# EAGLE design SchlafKindleinSchlaf (EAGLE 6.5.0)
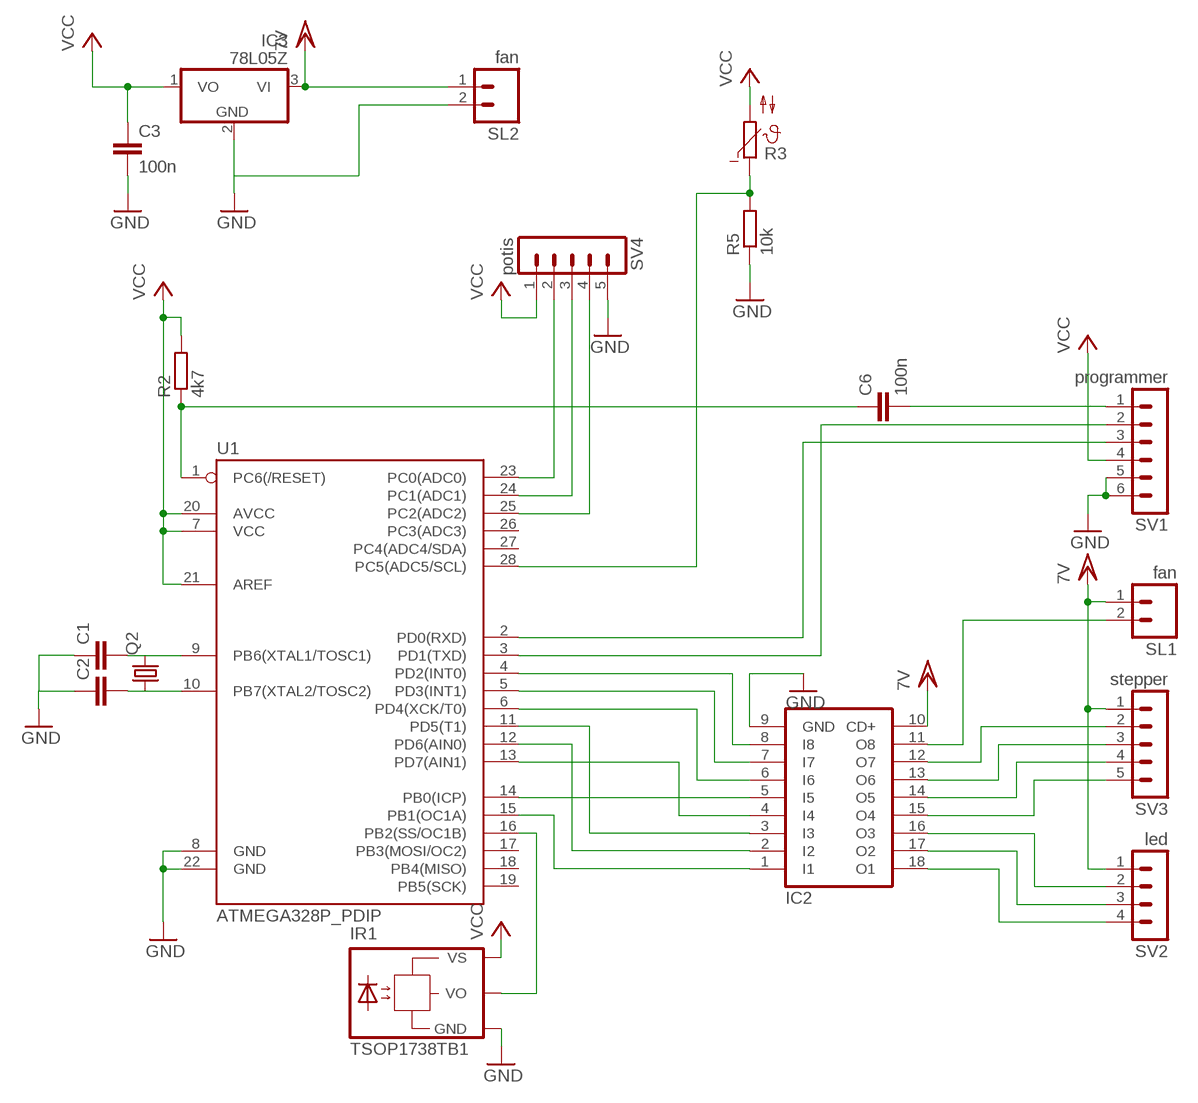
[diagram p0: schematic, sheet 1]

## Parts
C1  C2.5/2  [C2.5-2]
C2  C2.5/2  [C2.5-2]
C3  100n  C2.5/2  [C2.5-2]
C6  100n  C2.5/2  [C2.5-2]
IC2  ULN2803A  [DIL18]
IC3  78L05Z  [TO92]
IR1  TSOP1738TB1  [TSOP17_TB1]
Q2  CRYSTALHC49S  [HC49/S]
R2  4k7  R-EU_0207/7  [0207/7]
R3  NTC640  [P640]
R5  10k  R-EU_0207/7  [0207/7]
SL1  fan  MA02  [02PA]
SL2  fan  MA02  [02PA]
SV1  programmer  MA06-1  [MA06-1]
SV2  led  MA04-1  [MA04-1]
SV3  stepper  MA05-1  [MA05-1]
SV4  potis  MA05-1  [MA05-1]
U1  ATMEGA328P_PDIP  [DIL28-3]

## Nets
GND: C1.1 C2.1 C3.2 IC2.9(GND) IC3.2(GND) IR1.GND R5.1 SL2.2 SV1.5 SV1.6 SV4.5 U1.8(GND) U1.22(GND)
N$1: IC2.1(I1) U1.15(PB1(OC1A))
N$2: IC2.2(I2) U1.12(PD6(AIN0))
N$3: C1.2 Q2.2 U1.9(PB6(XTAL1/TOSC1))
N$4: C2.2 Q2.1 U1.10(PB7(XTAL2/TOSC2))
N$5: IR1.VO U1.16(PB2(SS/OC1B))
N$6: SV1.3 U1.2(PD0(RXD))
N$7: SV1.2 U1.3(PD1(TXD))
N$8: C6.2 SV1.1
N$9: C6.1 R2.1 U1.1(PC6(/RESET))
N$10: IC2.3(I3) U1.11(PD5(T1))
N$11: IC2.8(I8) U1.4(PD2(INT0))
N$12: IC2.7(I7) U1.5(PD3(INT1))
N$13: IC2.6(I6) U1.6(PD4(XCK/T0))
N$14: IC2.5(I5) U1.14(PB0(ICP))
N$15: IC2.4(I4) U1.13(PD7(AIN1))
N$16: IC2.11(O8) SL1.2
N$17: IC2.12(O7) SV3.2
N$18: IC2.13(O6) SV3.3
N$19: IC2.14(O5) SV3.4
N$20: IC2.15(O4) SV3.5
N$21: IC2.16(O3) SV2.2
N$22: IC2.17(O2) SV2.3
N$23: IC2.18(O1) SV2.4
N$24: SV4.2 U1.23(PC0(ADC0))
N$25: SV4.3 U1.24(PC1(ADC1))
N$26: SV4.4 U1.25(PC2(ADC2))
N$27: R3.1 R5.2 U1.28(PC5(ADC5/SCL))
VCC: C3.1 IC3.1(VO) IR1.VS R2.2 R3.2 SV1.4 SV4.1 U1.7(VCC) U1.20(AVCC) U1.21(AREF)
VCC/2: IC2.10(CD+) IC3.3(VI) SL1.1 SL2.1 SV2.1 SV3.1 ; supply symbol labelled 7V
Unconnected: U1.17(PB3(MOSI/OC2)) U1.18(PB4(MISO)) U1.19(PB5(SCK)) U1.26(PC3(ADC3)) U1.27(PC4(ADC4/SDA))

## Library data of the parts
C1-C3 C6 = capacitor-wima:C: CAPACITOR naming: grid - package width
IC2 = uln-udn:ULN2803A: DRIVER ARRAY
IC3 = linear:78*: Positive VOLTAGE REGULATOR Source: http://cache.national.com/ds/LM/LM78L05.pdf http://www.fairchildsemi.com/ds/LM/LM7805.pdf
IR1 = telefunken:TSOP17*TB1: TSOP17..TB1 IR Receiver Modules for Remote Control Systems Source: http://www.vishay.com/docs/82042/82042.pdf; OC_FARNELL: unknown; OC_NEWARK: unknown
Q2 = crystal:CRYSTAL: CRYSTAL; OC_FARNELL: 1667008; OC_NEWARK: unknown
R2 R5 = resistor:R-EU_: RESISTOR, European symbol
R3 = ptc-ntc:NTC640: PHILIPS NTC; OC_FARNELL: unknown; OC_NEWARK: unknown
SL1 SL2 = con-amp-quick:MA02: AMP QUICK CONNECTOR; OC_FARNELL: unknown; OC_NEWARK: unknown
SV1 = con-lstb:MA06-1: PIN HEADER; OC_FARNELL: unknown; OC_NEWARK: unknown
SV2 = con-lstb:MA04-1: PIN HEADER; OC_FARNELL: unknown; OC_NEWARK: unknown
SV3 SV4 = con-lstb:MA05-1: PIN HEADER; OC_FARNELL: unknown; OC_NEWARK: unknown
U1 = SparkFun-DigitalIC:ATMEGA328P_PDIP: uC used in the Arduino 32kb flash, 1k EEPROM, 2k SRAM This is the through-hole version of this chip.

## Board
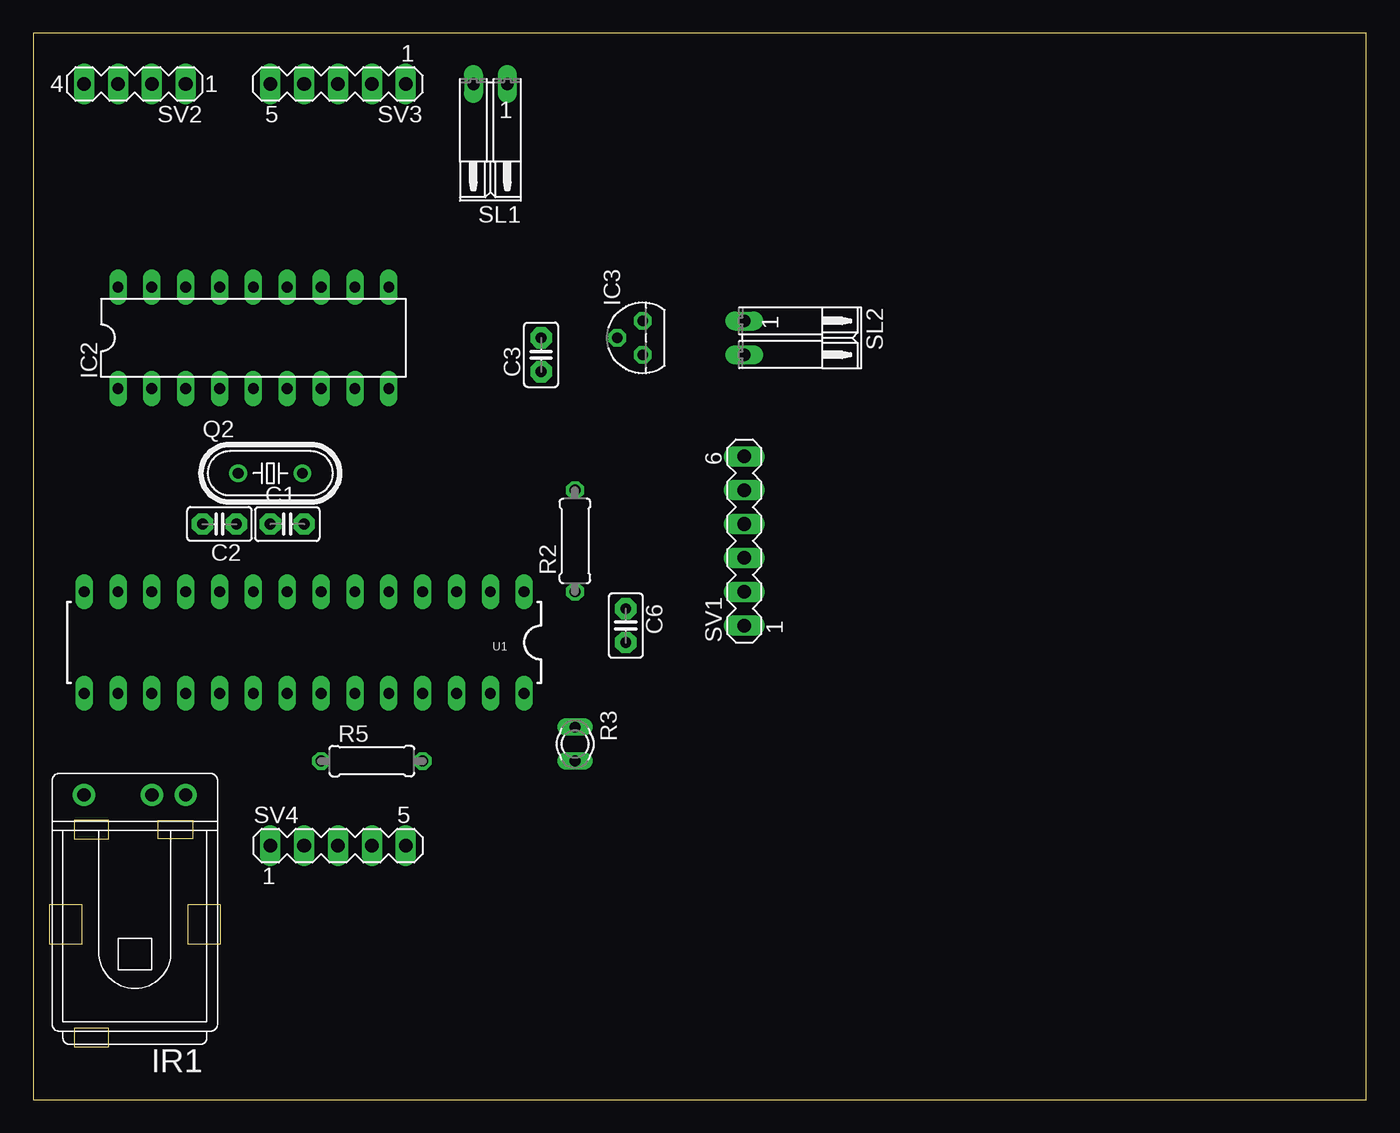
[diagram p1: board, top side]
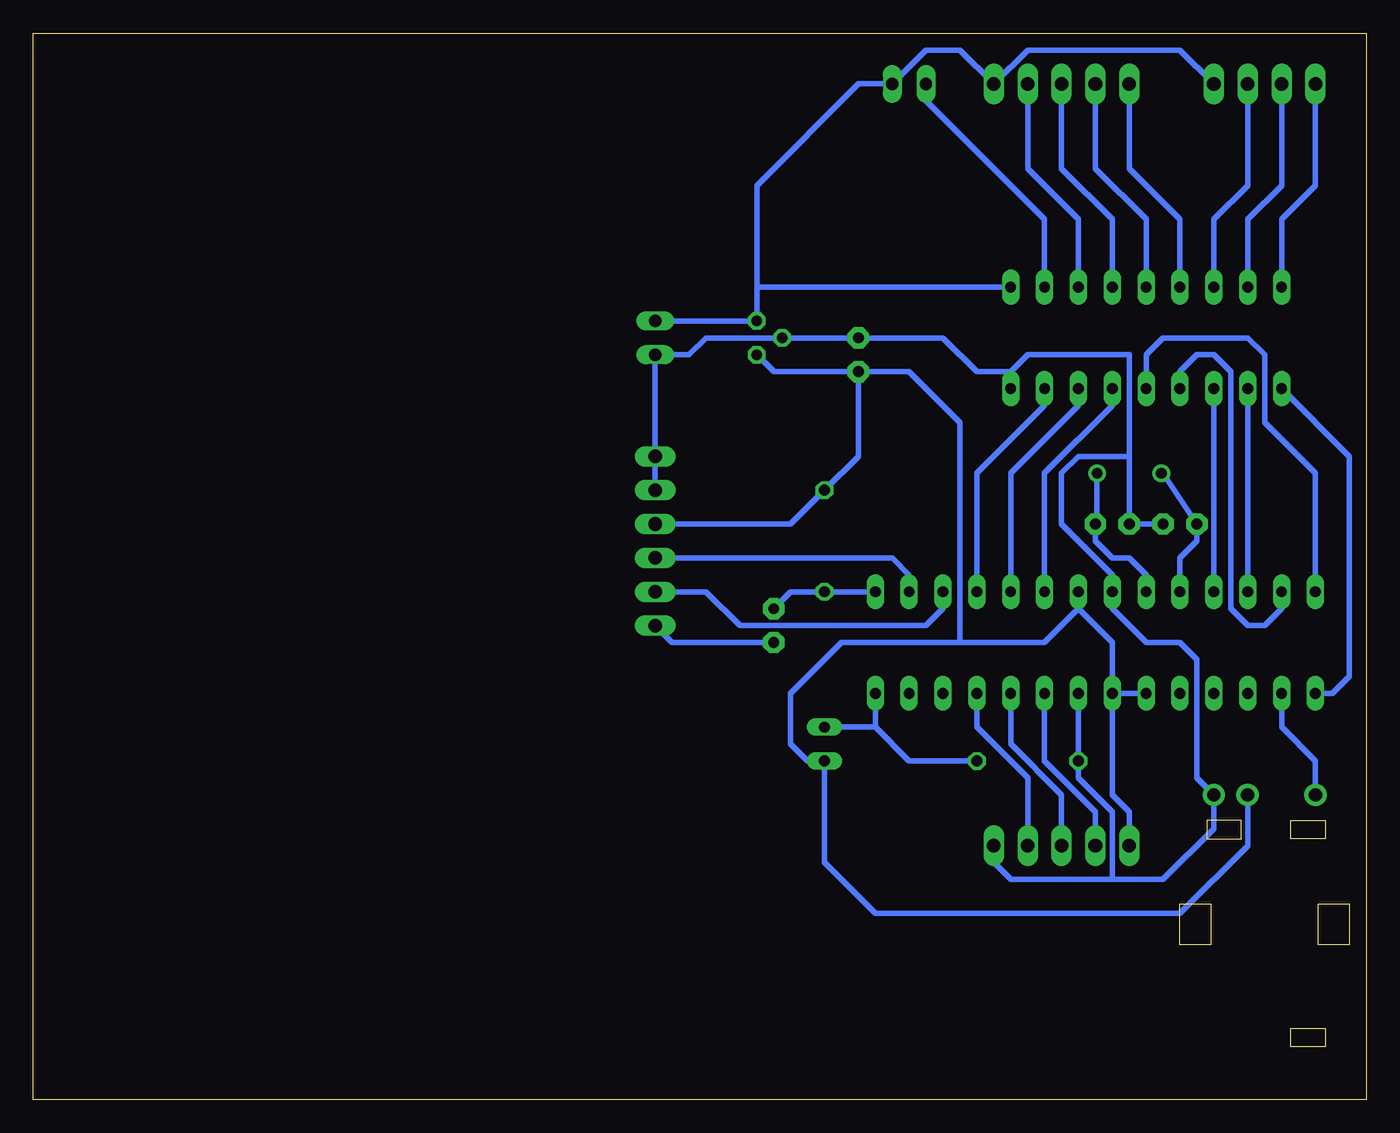
[diagram p2: board, bottom side, seen from below]

Size 100 x 80 mm. Coordinates in mm from the lower left corner, seen from the top.
Outline: 0,0 100,0 100,80 0,80 0,0
Copper layers (1*16): Top 0.035mm / dielectric 1.5mm / Bottom 0.035mm
Design rules "default": minimum track width 10mil, minimum drill 24mil, track to track 8mil, track to pad 8mil, pad to pad 8mil, via to via 8mil, smd to smd 8mil, copper to edge 40mil, drill to drill 8mil, minimum pad ring 10mil, minimum via ring 8mil, stop-mask expansion 4mil, vias tented up to drill 0mil, thermal gap 10mil

### Footprints (pad centres in the part's own frame; a part is rotated, then mirrored left to right if it is on the bottom)
C2.5-2 = drill 0.813 pad 1.6 octagon: 1 -1.27,0; 2 1.27,0
DIL18 = drill 0.813 long: 1 -10.16,-3.81; 2 -7.62,-3.81; 3 -5.08,-3.81; 4 -2.54,-3.81; 5 0,-3.81; 6 2.54,-3.81; 7 5.08,-3.81; 8 7.62,-3.81; 9 10.16,-3.81; 10 10.16,3.81; 11 7.62,3.81; 12 5.08,3.81; 13 2.54,3.81; 14 0,3.81; 15 -2.54,3.81; 16 -5.08,3.81; 17 -7.62,3.81; 18 -10.16,3.81
TO92 = drill 0.813 octagon: 1 -1.27,0; 2 0,1.905; 3 1.27,0
TSOP17_TB1 = drill 1 pad 1.676: GND 0,-3.81; VO 0,3.81; VS 0,-1.27
HC49/S = drill 0.813: 1 -2.413,0; 2 2.413,0
0207/7 = drill 0.813 octagon: 1 -3.81,0; 2 3.81,0
P640 = drill 0.813 long: 1 -1.27,0; 2 1.27,0
02PA = drill 0.914 long: 1 -1.27,0; 2 1.27,0
MA06-1 = drill 1.016 long: 1 -6.35,0; 2 -3.81,0; 3 -1.27,0; 4 1.27,0; 5 3.81,0; 6 6.35,0
MA04-1 = drill 1.016 long: 1 -3.81,0; 2 -1.27,0; 3 1.27,0; 4 3.81,0
MA05-1 = drill 1.016 long: 1 -5.08,0; 2 -2.54,0; 3 0,0; 4 2.54,0; 5 5.08,0
DIL28-3 = drill 0.813 long: 1 -16.51,-3.81; 2 -13.97,-3.81; 3 -11.43,-3.81; 4 -8.89,-3.81; 5 -6.35,-3.81; 6 -3.81,-3.81; 7 -1.27,-3.81; 8 1.27,-3.81; 9 3.81,-3.81; 10 6.35,-3.81; 11 8.89,-3.81; 12 11.43,-3.81; 13 13.97,-3.81; 14 16.51,-3.81; 15 16.51,3.81; 16 13.97,3.81; 17 11.43,3.81; 18 8.89,3.81; 19 6.35,3.81; 20 3.81,3.81; 21 1.27,3.81; 22 -1.27,3.81; 23 -3.81,3.81; 24 -6.35,3.81; 25 -8.89,3.81; 26 -11.43,3.81; 27 -13.97,3.81; 28 -16.51,3.81

### Placement (x,y rotation side)
C1  19.05,43.18 0 top
C2  13.97,43.18 180 top
C3  38.1,55.88 90 top
C6  44.45,35.56 270 top
IC2  16.51,57.15 0 top
IC3  45.72,57.15 90 top
IR1  7.62,22.86 90 top
Q2  17.78,46.99 0 top
R2  40.64,41.91 90 top
R3  40.64,26.67 270 top
R5  25.4,25.4 0 top
SL1  34.29,76.2 180 top
SL2  53.34,57.15 270 top
SV1  53.34,41.91 90 top
SV2  7.62,76.2 180 top
SV3  22.86,76.2 180 top
SV4  22.86,19.05 0 top
U1  20.32,34.29 180 top

### Tracks (layer width: path | path; a pad name or v marks a point on that pad's centre or on a via)
GND
  Bottom 0.406: SV1.5 SV1.6 SL2.2 50.8,55.88 49.53,57.15 45.72,57.15 44.45,57.15 IC3.2 C3.2 31.75,57.15 29.21,54.61 26.67,54.61 | C2.1 C1.1 17.78,48.26 | 17.78,48.26 17.78,55.88 25.4,55.88 26.67,54.61 | 26.67,54.61 IC2.9 | 17.78,48.26 21.59,48.26 22.86,46.99 22.86,43.18 19.05,39.37 U1.8 19.05,36.83 16.51,34.29 13.97,34.29 12.7,33.02 12.7,24.13 IR1.GND 11.43,20.32 15.24,16.51 19.05,16.51 | U1.22 R5.1 21.59,24.13 19.05,21.59 19.05,16.51 | 19.05,16.51 26.67,16.51 27.94,17.78 SV4.5
N$1
  Bottom 0.406: U1.15 2.54,30.48 1.27,31.75 1.27,48.26 IC2.1
N$2
  Bottom 0.406: IC2.2 U1.12
N$3
  Bottom 0.406: U1.9 16.51,39.37 17.78,40.64 19.05,40.64 20.32,41.91 C1.2 20.19,43.31 Q2.2
N$4
  Bottom 0.406: Q2.1 15.24,46.99 C2.2 12.7,41.91 13.97,40.64 U1.10
N$5
  Bottom 0.406: IR1.VO 3.81,25.4 6.35,27.94 U1.16
N$6
  Bottom 0.406: U1.2 34.29,39.37 35.56,40.64 SV1.3
N$7
  Bottom 0.406: U1.3 31.75,36.83 33.02,35.56 46.99,35.56 49.53,38.1 SV1.2
N$8
  Bottom 0.406: C6.2 52.07,34.29 SV1.1
N$9
  Bottom 0.406: U1.1 R2.1 43.18,38.1 C6.1
N$10
  Bottom 0.406: U1.11 IC2.3
N$11
  Bottom 0.406: U1.4 29.21,46.99 24.13,52.07 IC2.8
N$12
  Bottom 0.406: U1.5 26.67,46.99 21.59,52.07 IC2.7
N$13
  Bottom 0.406: U1.6 24.13,46.99 19.05,52.07 IC2.6
N$14
  Bottom 0.406: U1.14 3.81,46.99 7.62,50.8 7.62,55.88 8.89,57.15 15.24,57.15 16.51,55.88 IC2.5
N$15
  Bottom 0.406: U1.13 6.35,36.83 7.62,35.56 8.89,35.56 10.16,36.83 10.16,54.61 11.43,55.88 12.7,55.88 13.97,54.61 IC2.4
N$16
  Bottom 0.406: IC2.11 24.13,66.04 33.02,74.93 SL1.2
N$17
  Bottom 0.406: IC2.12 21.59,66.04 25.4,69.85 SV3.2
N$18
  Bottom 0.406: IC2.13 19.05,66.04 22.86,69.85 SV3.3
N$19
  Bottom 0.406: IC2.14 16.51,66.04 20.32,69.85 SV3.4
N$20
  Bottom 0.406: IC2.15 13.97,66.04 17.78,69.85 SV3.5
N$21
  Bottom 0.406: IC2.16 11.43,66.04 8.89,68.58 SV2.2
N$22
  Bottom 0.406: IC2.17 8.89,66.04 6.35,68.58 SV2.3
N$23
  Bottom 0.406: IC2.18 6.35,66.04 3.81,68.58 SV2.4
N$24
  Bottom 0.406: U1.23 24.13,25.4 20.32,21.59 SV4.2
N$25
  Bottom 0.406: U1.24 26.67,26.67 22.86,22.86 SV4.3
N$26
  Bottom 0.406: U1.25 29.21,27.94 25.4,24.13 SV4.4
N$27
  Bottom 0.406: R5.2 34.29,25.4 36.83,27.94 | 36.83,27.94 U1.28 | R3.1 36.83,27.94
VCC
  Bottom 0.406: 21.59,36.83 19.05,34.29 U1.21 | C3.1 44.45,54.61 IC3.1 | SV1.4 43.18,43.18 R2.2 38.1,48.26 C3.1 | U1.7 21.59,36.83 | 21.59,36.83 24.13,34.29 30.48,34.29 | 30.48,34.29 30.48,50.8 34.29,54.61 C3.1 | 30.48,34.29 39.37,34.29 43.18,30.48 43.18,26.67 41.91,25.4 R3.2 40.64,17.78 36.83,13.97 13.97,13.97 8.89,19.05 IR1.VS | U1.21 19.05,22.86 17.78,21.59 SV4.1 | U1.20 U1.21
VCC/2
  Bottom 0.406: SL2.1 IC3.3 45.72,60.96 | 45.72,60.96 45.72,68.58 38.1,76.2 SL1.1 33.02,78.74 30.48,78.74 SV3.1 25.4,78.74 13.97,78.74 SV2.1 | IC2.10 45.72,60.96